# Altium schematic sheet BoostSchDoc.SchDoc
size Letter
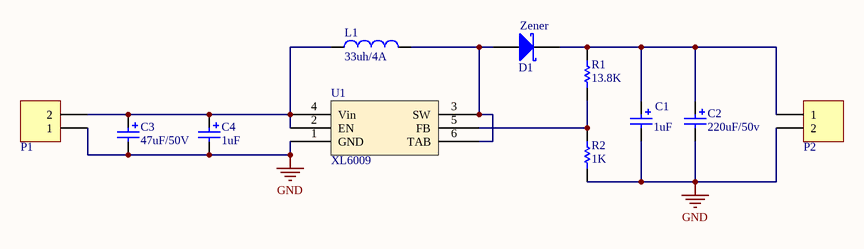
[diagram p0: BoostSchDoc.SchDoc]

## Parts
C1  value 1uF  [CAP ALU SIZE B]  (hidden comment: Cap Pol SMD)
C2  value 220uF/50v  [CAP ALU SIZE B]  (hidden comment: Cap Pol SMD)
C3  value 47uF/50V  [CAP ALU SIZE B]  (hidden comment: Cap Pol SMD)
C4  value 1uF  [CAP ALU SIZE B]  (hidden comment: Cap Pol SMD)
D1  Zener  [SS34]
L1  value 33uh/4A  [INDUCTOR 12.5x12.5]  (hidden comment: Inductor)
P1  Domino 2  [DOMINO 2- 5mm]  (value not drawn)
P2  Domino 2  [DOMINO 2- 5mm]  (value not drawn)
R1  value 13.8K  [RES-SM-0603]  (hidden comment: RESISTOR SMD)
R2  value 1K  [RES-SM-0603]  (hidden comment: RESISTOR SMD)
U1  XL6009  [LM2596]

## Nets
GND: C1.2 C2.2 C3.2 C4.2 P1.1 P2.2 R2.1 U1.1(GND)
NetC1_1: C1.1 C2.1 D1.2(K) P2.1 R1.2
NetC3_1: C3.1 C4.1 L1.1 P1.2 U1.2(EN) U1.4(Vin)
NetD1_1: D1.1(A) L1.2 U1.3(SW) U1.6(TAB)
NetR1_1: R1.1 R2.2 U1.5(FB)

## Library data of the parts
C1-C4 = Cap Pol SMD: Polarized Capacitor (Radial)
D1 = D Schottky: Schottky Diode; Published: 8-Jun-2000; LatestRevisionDate: 17-Jul-2002; LatestRevisionNote: Re-released for DXP Platform.; PackageReference: SMB; Publisher: Altium Limited; PackageDescription: DO-214-AA/SMB; 2 C-Bend Leads; Body 5.3 x 3.6 mm, inc. leads (LxW); Code_JEDEC: DO-214-AA
P1 P2 = Domino 2: Domino, 2-Pin; LatestRevisionDate: 17-Jul-2002; LatestRevisionNote: Re-released for DXP Platform.; Publisher: Altium Limited
R1 R2 = RESISTOR SMD: Resistor
U1 = XL6009: SMD